# EasyEDA Pro project WEN-FDC2214电容检测.epro

# Board PCB39
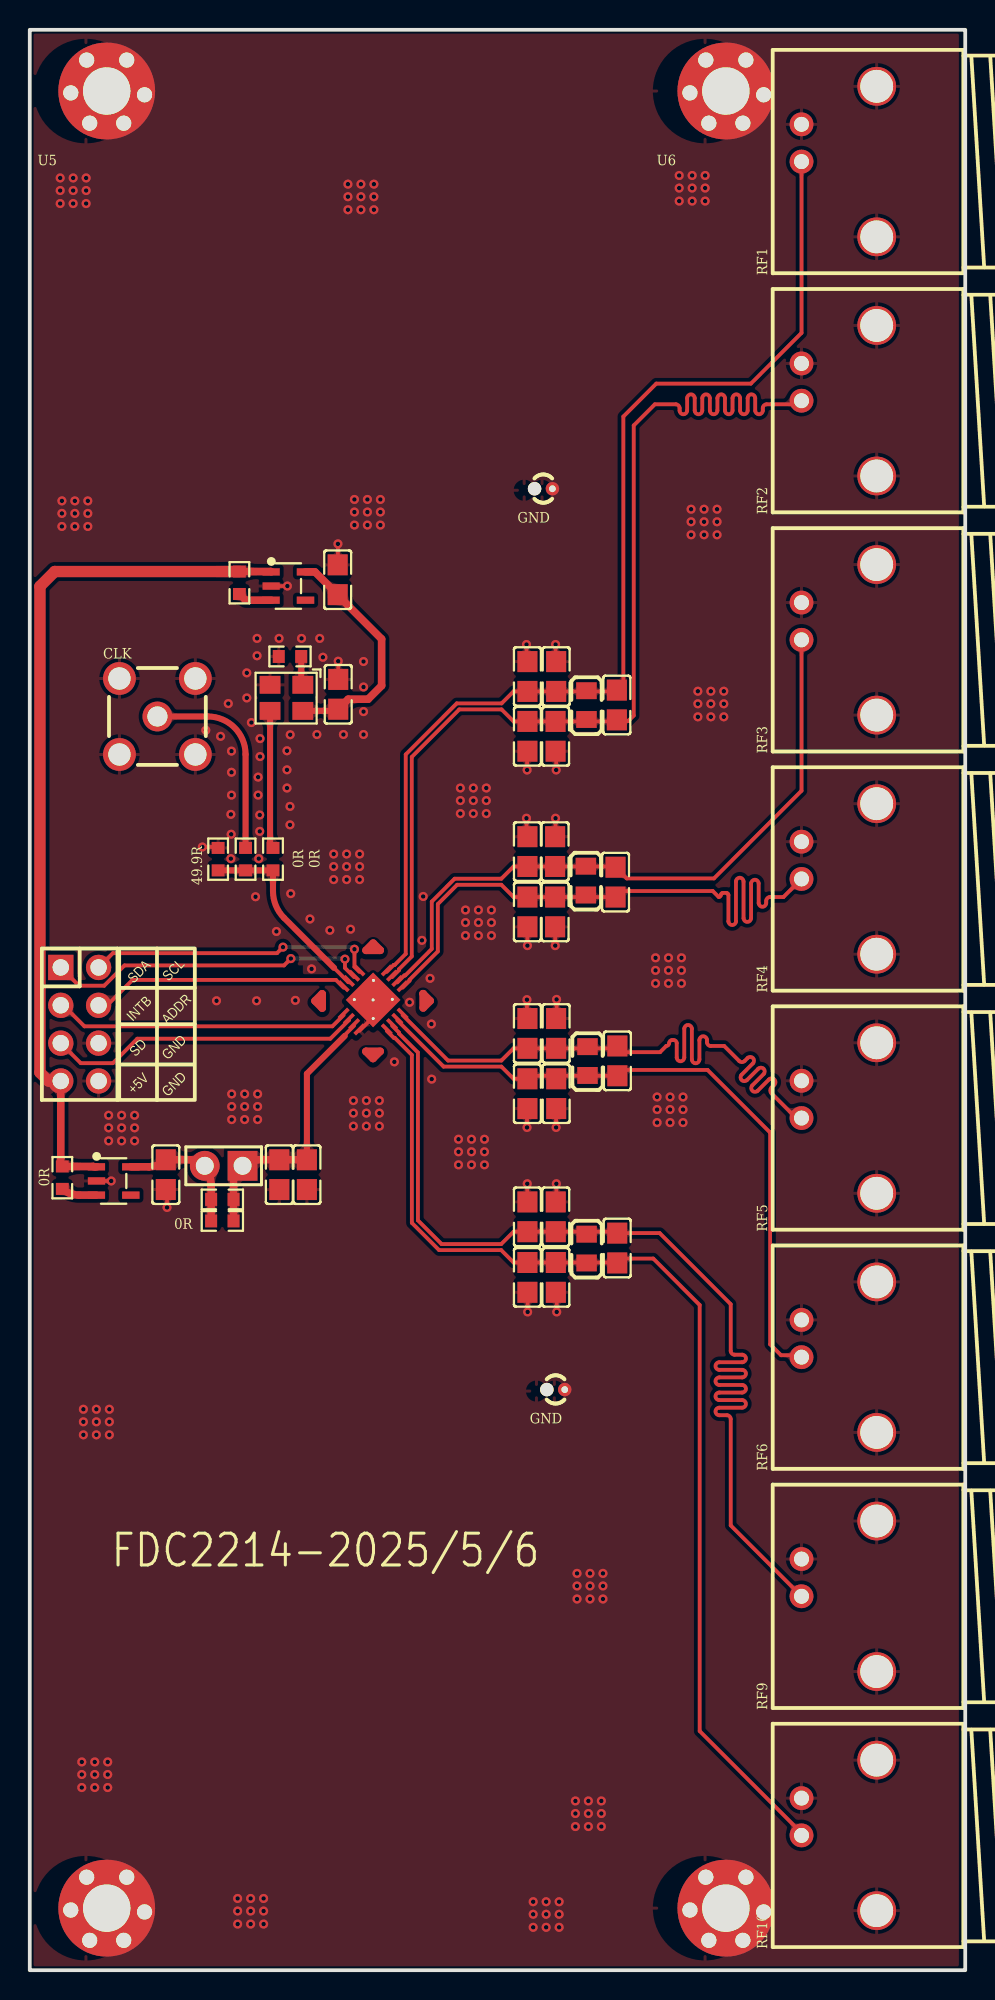
[diagram p0: board, top side]
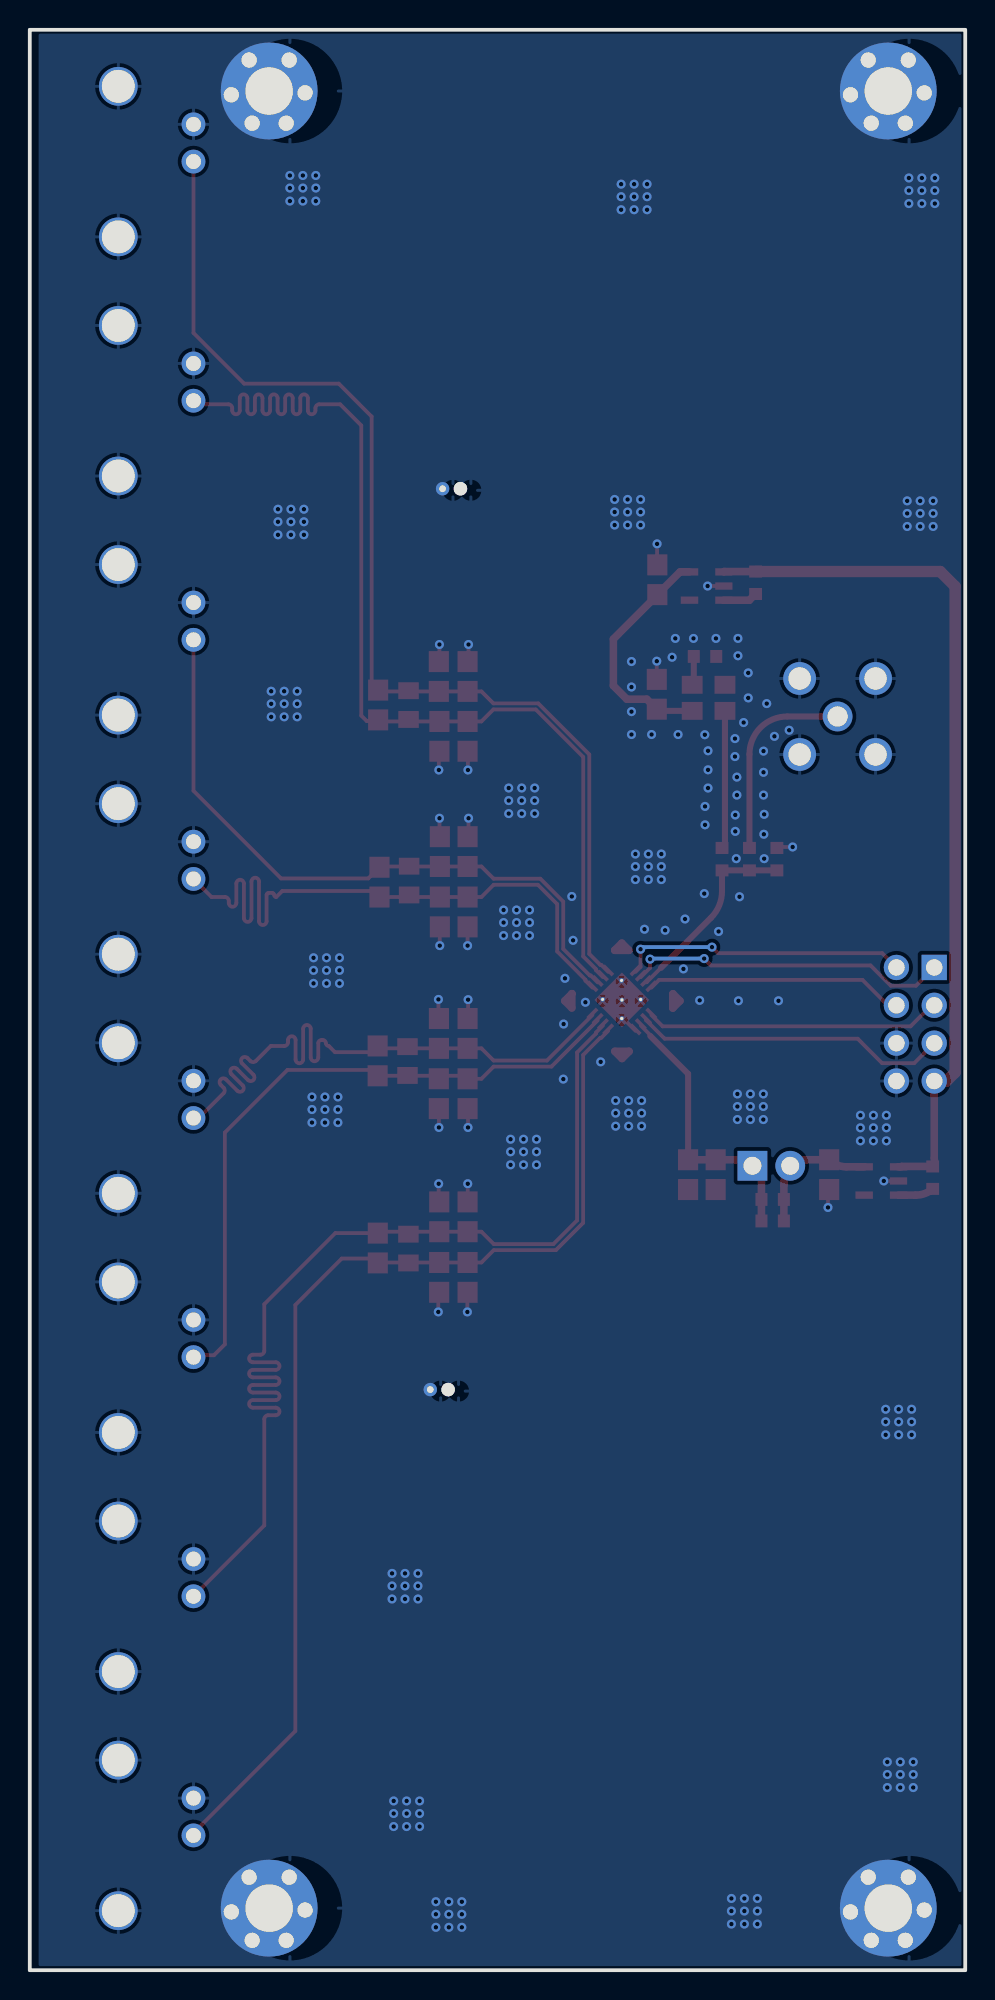
[diagram p1: board, bottom side, seen from below]

Outline 62.83 x 130.2 mm; copper layers: Top Layer, Bottom Layer. Coordinates in mm from the lower left corner of the outline.
Outline path: rectangle 0,130.2 62.83,0
Stack: Top Layer 0.035mm / Dielectric1 1.51mm FR4 er 4.5 / Bottom Layer 0.035mm

## Design rules (mm)
net $1N3217: DP1
net $1N2785: DP1
net $1N3521: DP2
net $1N3494: DP2
net $1N3836: DP4
net $1N3809: DP4
net $1N4151: DP3
net $1N4269: DP3
template: JLCPCB Capability(Two Layers Board)
spacing copperThickness1oz (default): track to track 0.102, other pairs 0.152 to 0.3
spacing copperThickness2oz: track to track 0.203, other pairs 0.152 to 0.3
track width copperThickness1oz (default): min 0.127, default 0.254, max 2.54
track width copperThickness2oz: min 0.203, default 0.254, max 2.54
differential pair differentialPair (default): width min 0.127, default 0.254, max 2.54; gap min 0.152, default 0.152
via viaSize (default): diameter min 0.5, default 0.61, max 10; hole min 0.3, default 0.305, max 6.3

## Placement (name value [footprint] x y rotation side)
0R  -  [R0603]  14.49 74.55 270 top
0R1  0R  [R0603]  17.48 88.15 180 top
0R2  0R  [R0603]  14.08 93.1 90 top
0R#2  -  [R0603]  16.34 74.55 270 top
0R#3  -  [R0603]  2.19 53.18 90 top
0R#4  -  [R0603]  12.93 51.72 0 top
4.7uF  4.7uF  [C0805]  9.14 53.38 90 top
4.7uF1  4.7uF  [C0805]  20.68 93.3 270 top
33pF  -  [C0805]  39.43 84.9 90 top
33pF#2  -  [C0805]  39.34 73.01 90 top
33pF#3  -  [C0805]  39.47 61.02 90 top
33pF#4  -  [C0805]  39.46 48.46 90 top
49.9R  49.9R  [R0603]  12.65 74.55 270 top
100nF  -  [C0805]  16.76 53.38 90 top
100nF2  10nF  [C0805]  20.72 85.61 270 top
100nF#2  -  [C0805]  18.61 53.38 90 top
100nF#3  -  [C0805]  33.42 86.81 270 top
100nF#4  -  [C0805]  33.42 82.79 270 top
100nF#5  -  [C0805]  35.35 86.81 270 top
100nF#6  -  [C0805]  35.32 82.79 270 top
100nF#7  -  [C0805]  35.28 75.06 270 top
100nF#8  -  [C0805]  35.28 71.01 270 top
100nF#9  -  [C0805]  33.42 75.06 270 top
100nF#10  -  [C0805]  33.42 71.01 270 top
100nF#11  -  [C0805]  33.42 62.86 270 top
100nF#12  -  [C0805]  35.36 58.82 270 top
100nF#13  -  [C0805]  35.35 62.86 270 top
100nF#14  -  [C0805]  33.42 58.81 270 top
100nF#15  -  [C0805]  35.33 50.55 270 top
100nF#16  -  [C0805]  35.33 46.49 270 top
100nF#17  -  [C0805]  33.42 50.55 270 top
100nF#18  -  [C0805]  33.42 46.49 270 top
CLK  BWSMA-KE-Z001  [SMA-TH_BWSMA-KE-Z001]  8.57 84.13 0 top
GND  -  [测试环]  33.8 99.36 0 top
GND#2  -  [测试环]  34.63 38.91 0 top
H1  PZ254V-12-8P  [HDR-TH_8P-P2.54-V-M-R2-C4-S2.54]  3.35 63.48 270 top
J1  PZ254V-11-02P  [HDR-TH_2P-P2.54-V-M]  13.02 53.98 180 top
L1  18uH  [L0805]  37.39 84.89 90 top
L2  18uH  [L0805]  37.35 73.11 90 top
L3  18uH  [L0805]  37.46 61 90 top
L5  18uH  [L0805]  37.4 48.42 90 top
OSC1  40MHz  [OSC-SMD_4P-L3.2-W2.5-BL]  17.24 85.38 180 top
R2  0R  [R0603]  12.93 50.28 0 top
RF1  KH-BNC50-3511  [ANT-TH_KH-BNC50-3511]  54.36 121.36 90 top
RF2  KH-BNC50-3511  [ANT-TH_KH-BNC50-3511]  54.36 105.31 90 top
RF3  KH-BNC50-3511  [ANT-TH_KH-BNC50-3511]  54.36 89.27 90 top
RF4  KH-BNC50-3511  [ANT-TH_KH-BNC50-3511]  54.36 73.22 90 top
RF5  KH-BNC50-3511  [ANT-TH_KH-BNC50-3511]  54.36 57.18 90 top
RF6  KH-BNC50-3511  [ANT-TH_KH-BNC50-3511]  54.36 41.13 90 top
RF9  KH-BNC50-3511  [ANT-TH_KH-BNC50-3511]  54.36 25.09 90 top
RF10  KH-BNC50-3511  [ANT-TH_KH-BNC50-3511]  54.36 9.05 90 top
U1  FDC2212  [WQFN RGH-16]  23.06 65.01 315 top
U2  SPX3819M5-L-3-3/TR  [SOT-23-5_L3.0-W1.7-P0.95-LS2.8-BL]  5.63 52.96 270 top
U3  -  [My_M3螺丝孔]  3.77 4.16 0 top
U4  -  [My_M3螺丝孔]  45.35 4.16 0 top
U5  -  [My_M3螺丝孔]  3.77 126.1 0 top
U6  -  [My_M3螺丝孔]  45.35 126.1 0 top
U7  SPX3819M5-L-3-3/TR  [SOT-23-5_L3.0-W1.7-P0.95-LS2.8-BL]  17.37 92.88 270 top

## Footprints (pads in the part's own frame, mm; a bottom-side part is the same pattern mirrored in y, then rotated)
ANT-TH_KH-BNC50-3511
  round 1.6 hole 1: 1(0,2.525) 2(2.5,2.525)
  round 2.601 hole 2.2: 3(5.05,-2.525) 4(-5.05,-2.525)
C0805
  rect 1.41x1.35 smd: 1(-1,0) 2(1,0)
HDR-TH_2P-P2.54-V-M
  rect 2x2 hole 1.2: 1(-1.27,0)
  round 2 hole 1.2: 2(1.27,0)
HDR-TH_8P-P2.54-V-M-R2-C4-S2.54
  rect 1.7x1.7 hole 1.1: 1(-3.81,-1.27)
  round 1.7 hole 1.1: 2(-3.81,1.27) 3(-1.27,-1.27) 4(-1.27,1.27) 5(1.27,-1.27) 6(1.27,1.27) 7(3.81,-1.27) 8(3.81,1.27)
L0805
  rect 1.133x1.377 smd: 1(-0.966,0) 2(0.966,0)
My_M3螺丝孔
  round 1.016 hole 1.021x1.016: 1(-1.016,-0.127) 1(0.051,2.078) 1(0.254,-2.159) 1(2.54,-2.159) 1(2.743,2.078) 1(3.937,-0.254)
  round 6.5 hole 3.18x3.175: 1(1.397,0)
OSC-SMD_4P-L3.2-W2.5-BL
  rect 1.4x1.2 smd: 1(-1.1,-0.875) 2(1.1,-0.875) 3(1.1,0.875) 4(-1.1,0.875)
R0603
  rect 0.806x0.864 smd: 1(-0.753,0) 2(0.753,0)
SMA-TH_BWSMA-KE-Z001
  round 2.2 hole 1.5: 1(-2.55,-2.55) 2(-2.55,2.55) 3(2.55,2.55) 4(2.55,-2.55)
  round 2 hole 1.35: 5(0,0)
SOT-23-5_L3.0-W1.7-P0.95-LS2.8-BL
  rect 0.49x1.157 smd: 1(-0.95,-1.153) 2(0,-1.153) 3(0.95,-1.153)
  rect 0.49x1.175 smd: 4(0.95,1.153) 5(-0.95,1.153)
WQFN RGH-16
  rect 0.9x0.25 smd: 1(-2.118,0.819) 2(-2.118,0.319) 3(-2.118,-0.181) 4(-2.118,-0.681) 9(1.982,-0.681) 10(1.982,-0.181) 11(1.982,0.319) 12(1.982,0.819)
  rect 0.25x0.9 smd: 5(-0.818,-1.982) 6(-0.318,-1.982) 7(0.182,-1.982) 8(0.682,-1.982) 13(0.682,2.119) 14(0.182,2.119) 15(-0.318,2.119) 16(-0.818,2.119)
  round 0.3 hole 0.2: 17(-0.977,1.008) 17(-0.977,-0.806) 17(-0.068,0.069) 17(0.821,1.008) 17(0.821,-0.807)
  rect 2.6x2.6 smd: 17(-0.068,0.069)
测试环
  round 0.9 hole 0.914x0.45: 1(0.103,0.051)
  round 0.9 hole 0.45: 1(1.304,0.051)

## Nets
3V3: 0R#4.1 4.7uF.2 J1.2 R2.1 U2.5
+5V: 0R2.2 0R#3.2 H1.7 U2.1 U7.1
D3V3: 4.7uF1.2 100nF2.2 OSC1.4 U7.5
GND: 0R1.2 4.7uF.1 4.7uF1.1 49.9R.1 100nF.1 100nF2.1 100nF#2.1 100nF#3.1 100nF#4.2 100nF#5.1 100nF#6.2 100nF#7.1 100nF#8.2 100nF#9.1 100nF#10.2 100nF#11.1 100nF#12.2 100nF#13.1 100nF#14.2 100nF#15.1 100nF#16.2 100nF#17.1 100nF#18.2 CLK.1 CLK.2 CLK.3 CLK.4 GND.1 GND#2.1 H1.6 H1.8 OSC1.2 RF1.2 RF1.3 RF1.4 RF2.2 RF2.3 RF2.4 RF3.2 RF3.3 RF3.4 RF4.2 RF4.3 RF4.4 RF5.2 RF5.3 RF5.4 RF6.2 RF6.3 RF6.4 RF9.2 RF9.3 RF9.4 RF10.2 RF10.3 RF10.4 U1.8 U1.17 U2.2 U3.1 U4.1 U5.1 U6.1 U7.2
VDD: 0R#4.2 100nF.2 100nF#2.2 J1.1 R2.2 U1.7
ADDR: H1.4 U1.4
INTB: H1.3 U1.5
SCL: H1.2 U1.1
SD: H1.5 U1.6
SDA: H1.1 U1.2
$1N1626: 0R.1 CLK.5
$1N1630: 0R.2 0R#2.2 49.9R.2 U1.3
$1N1964: 0R1.1 OSC1.1
$1N2113: 0R#2.1 OSC1.3
$1N2627: 0R#3.1 U2.3
$1N2785: 33pF.1 100nF#4.1 100nF#6.1 L1.1 RF2.1 U1.15
$1N3217: 33pF.2 100nF#3.2 100nF#5.2 L1.2 RF1.1 U1.16
$1N3494: 33pF#2.1 100nF#8.1 100nF#10.1 L2.1 RF4.1 U1.13
$1N3521: 33pF#2.2 100nF#7.2 100nF#9.2 L2.2 RF3.1 U1.14
$1N3809: 33pF#3.1 100nF#12.1 100nF#14.1 L3.1 RF6.1 U1.11
$1N3836: 33pF#3.2 100nF#11.2 100nF#13.2 L3.2 RF5.1 U1.12
$1N4151: 33pF#4.2 100nF#15.2 100nF#17.2 L5.2 RF9.1 U1.10
$1N4269: 33pF#4.1 100nF#16.1 100nF#18.1 L5.1 RF10.1 U1.9
$1N6832: 0R2.1 U7.3

Pads without a net: U2 4; U7 4

## Via types
v1: diameter 0.61, hole 0.305, Top Layer to Bottom Layer, 278 vias

## Routing (per net, layer and track width the routed paths; a pad name or vN(x,y) marks a point on that pad's centre or on a via; arc(x,y) is an arc through that point)
3V3: length 9.2
  Top Layer w0.508: U2.5 7.99,53.91 arc(8.61,54.03) 4.7uF.2 10.77,54.38 arc(11.2,54.32) 11.58,54.12 ; R2.1 0R#4.1 12.18,52.67 arc(12.02,53.46) 11.58,54.12 ; 11.58,54.12 arc(11.67,54.05) J1.2
+5V: length 58.3
  Top Layer w0.508: 0R2.2 16.19,93.85 U7.1 ; H1.7 2.08,54.49 arc(2.08,54.2) 0R#3.2 4.26,53.93 arc(4.37,53.89) U2.1
  Top Layer w0.762: H1.7 1.25,59.67 0.68,60.24 0.68,92.85 1.68,93.85 0R2.2
D3V3: length 16.1
  Top Layer w0.406: 100nF2.2 20.6,84.5 OSC1.4
  Top Layer w0.508: 100nF2.2 21.39,85.29 22.73,85.29 23.63,86.19 23.63,89.32 20.68,92.27 4.7uF1.2 19.15,93.83 U7.5
GND: length 29.9
  Top Layer w0.254: 22.14,63.03 23.06,63.95 23.06,65.01 ; 33.36,87.75 33.36,89.03 ; 33.41,51.57 33.41,52.84 ; 33.4,57.83 v1(33.4,56.55) ; 35.35,57.76 35.35,56.48 ; 35.39,45.38 35.39,44.1 ; v1(11.59,75.37) 12.59,75.37 arc(12.63,75.35) 49.9R.1 ; 33.4,81.81 v1(33.4,80.53) ; 35.37,51.49 v1(35.37,52.77) ; 35.29,70.03 v1(35.29,68.75) ; v1(20.7,95.71) 20.7,94.32 4.7uF1.1 ; 35.38,63.86 v1(35.38,65.14) ; 33.39,63.84 v1(33.39,65.12) ; U7.2 v1(17.3,92.88) ; 35.31,87.68 v1(35.31,88.96) ; 33.44,45.45 v1(33.44,44.17) ; 33.36,76.09 33.36,77.37 ; 100nF2.1 v1(20.72,87.84) ; 35.36,81.74 35.36,80.46 ; 35.31,76.02 v1(35.31,77.3) ; U2.2 v1(5.47,52.96) ; 100nF#10.2 33.42,68.73 ; v1(9.22,51.18) 9.22,52.19 arc(9.2,52.29) 4.7uF.1
  vias: v1(2.04,120.26) v1(2.04,119.42) v1(2.04,118.54) v1(2.16,98.59) v1(2.16,97.75) v1(2.16,96.88) v1(2.91,120.26) v1(2.91,119.42) v1(2.91,118.54) v1(3.03,98.59) v1(3.03,97.75) v1(3.03,96.88) v1(3.49,13.97) v1(3.49,13.13) v1(3.49,12.26) v1(3.6,37.64) v1(3.6,36.8) v1(3.6,35.92) v1(3.79,120.26) v1(3.79,119.42) v1(3.79,118.54) v1(3.9,98.59) v1(3.9,97.75) v1(3.9,96.88) v1(4.36,13.97) v1(4.36,13.13) v1(4.36,12.26) v1(4.47,37.64) v1(4.47,36.8) v1(4.47,35.92) v1(5.23,13.97) v1(5.23,13.13) v1(5.23,12.26) v1(5.3,57.37) v1(5.3,56.52) v1(5.3,55.65) v1(5.34,37.64) v1(5.34,36.8) v1(5.34,35.92) v1(6.17,57.37) v1(6.17,56.52) v1(6.17,55.65) v1(7.04,57.37) v1(7.04,56.52) v1(7.04,55.65) v1(11.83,83.2) v1(12.54,65.05) v1(12.82,82.79) v1(13.33,84.99) v1(13.55,81.8) v1(13.55,80.38) v1(13.55,78.85) v1(13.51,77.56) v1(13.53,76.22) v1(13.51,74.59) v1(13.56,58.8) v1(13.56,57.95) v1(13.56,57.08) v1(13.96,4.81) v1(13.96,3.97) v1(13.96,3.1) v1(14.43,58.8) v1(14.43,57.95) v1(14.43,57.08) v1(14.58,87.05) v1(14.58,85.37) v1(14.88,83.72) v1(14.83,4.81) v1(14.83,3.97) v1(14.83,3.1) v1(15.16,72.03) v1(15.26,89.36) v1(15.26,88.2) v1(15.23,65.05) v1(15.34,80.06) v1(15.34,78.85) v1(15.38,74.59) v1(15.3,58.8) v1(15.3,57.95) v1(15.3,57.08) v1(15.47,82.64) v1(15.47,81.44) v1(15.44,77.52) v1(15.44,76.42) v1(15.7,4.81) v1(15.7,3.97) v1(15.7,3.1) v1(16.57,69.7) v1(16.74,89.36) v1(17.28,81.82) v1(17.28,80.55) v1(17.28,79.33) v1(17.49,82.9) v1(17.48,78.09) v1(17.48,76.85) v1(17.53,72.24) v1(17.84,65.08) v1(18.25,89.36) v1(18.82,70.54) v1(18.93,67.19) v1(19.29,82.92) v1(19.47,89.36) v1(19.69,88.1) v1(20.16,69.78) v1(20.41,74.9) v1(20.41,74.05) v1(20.41,73.18) v1(21.07,82.92) v1(21.28,74.9) v1(21.28,74.05) v1(21.28,73.18) v1(21.37,119.85) v1(21.37,119) v1(21.37,118.13) v1(21.54,69.85) v1(21.74,58.35) v1(21.74,57.51) v1(21.74,56.63) v1(21.81,98.69) v1(21.81,97.85) v1(21.81,96.97) v1(22.15,74.9) v1(22.15,74.05) v1(22.15,73.18) v1(22.24,119.85) v1(22.24,119) v1(22.24,118.13) v1(22.42,87.81) v1(22.42,86.1) v1(22.42,84.45) v1(22.42,82.92) v1(22.68,98.69) v1(22.68,97.85) v1(22.68,96.97) v1(22.61,58.35) v1(22.61,57.51) v1(22.61,56.63) v1(23.11,119.85) v1(23.11,119) v1(23.11,118.13) v1(23.48,58.35) v1(23.48,57.51) v1(23.48,56.63) v1(23.55,98.69) v1(23.55,97.85) v1(23.55,96.97) v1(24.49,60.95) v1(25.51,64.95) v1(26.34,69.1) v1(26.42,72.05) v1(26.88,66.55) v1(26.97,63.49) v1(26.99,59.79) v1(28.8,55.76) v1(28.8,54.92) v1(28.8,54.04) v1(28.92,79.33) v1(28.92,78.48) v1(28.92,77.61) v1(29.26,71.14) v1(29.26,70.3) v1(29.26,69.42) v1(29.67,55.76) v1(29.67,54.92) v1(29.67,54.04) v1(29.79,79.33) v1(29.79,78.48) v1(29.79,77.61) v1(30.14,71.14) v1(30.14,70.3) v1(30.14,69.42) v1(30.54,55.76) v1(30.54,54.92) v1(30.54,54.04) v1(30.66,79.33) v1(30.66,78.48) v1(30.66,77.61) v1(31.01,71.14) v1(31.01,70.3) v1(31.01,69.42) v1(33.36,88.96) v1(33.36,77.3) v1(33.42,68.75) v1(33.41,52.77) v1(33.81,4.59) v1(33.81,3.75) v1(33.81,2.88) v1(34.68,4.59) v1(34.68,3.75) v1(34.68,2.88) v1(35.36,80.53) v1(35.35,56.55) v1(35.39,44.17) v1(35.55,4.59) v1(35.55,3.75) v1(35.55,2.88) v1(36.65,11.36) v1(36.65,10.51) v1(36.65,9.64) v1(36.76,26.63) v1(36.76,25.78) v1(36.76,24.91) v1(37.52,11.36) v1(37.52,10.51) v1(37.52,9.64) v1(37.63,26.63) v1(37.63,25.78) v1(37.63,24.91) v1(38.39,11.36) v1(38.39,10.51) v1(38.39,9.64) v1(38.5,26.63) v1(38.5,25.78) v1(38.5,24.91) v1(42.03,67.93) v1(42.03,67.09) v1(42.03,66.22) v1(42.13,58.59) v1(42.13,57.75) v1(42.13,56.88) v1(42.9,67.93) v1(42.9,67.09) v1(42.9,66.22) v1(43,58.59) v1(43,57.75) v1(43,56.88) v1(43.62,120.43) v1(43.62,119.58) v1(43.62,118.71) v1(43.77,67.93) v1(43.77,67.09) v1(43.77,66.22) v1(43.88,58.59) v1(43.88,57.75) v1(43.88,56.88) v1(44.49,120.43) v1(44.49,119.58) v1(44.49,118.71) v1(44.42,98.03) v1(44.42,97.19) v1(44.42,96.32) v1(44.87,85.82) v1(44.87,84.98) v1(44.87,84.1) v1(45.29,98.03) v1(45.29,97.19) v1(45.29,96.32) v1(45.36,120.43) v1(45.36,119.58) v1(45.36,118.71) v1(45.74,85.82) v1(45.74,84.98) v1(45.74,84.1) v1(46.16,98.03) v1(46.16,97.19) v1(46.16,96.32) v1(46.61,85.82) v1(46.61,84.98) v1(46.61,84.1)
VDD: length 18.7
  Top Layer w0.254: 21.79,63.38 21.14,62.74 21.19,62.69
  Top Layer w0.406: 21.15,62.69 18.61,60.15 100nF#2.2
  Top Layer w0.508: R2.2 0R#4.2 13.69,53.37 J1.1 arc(14.74,54.28) 15.27,54.38 100nF.2 100nF#2.2
ADDR: length 17.4
  Top Layer w0.254: H1.4 5.2,64.75 6.9,66.45 20.56,66.45 21.08,65.93
INTB: length 19.9
  Top Layer w0.254: H1.3 2.26,64.75 3.67,63.33 20.32,63.33 21.08,64.09
SCL: length 19.5
  Top Layer w0.254: v1(17.01,68.65) 16.6,68.24 5.58,68.24 H1.2 ; v1(21.81,68.51) 21.81,67.32 22.14,66.99
  Bottom Layer w0.254: v1(17.01,68.65) 21.67,68.65 v1(21.81,68.51)
SD: length 21.1
  Top Layer w0.254: H1.5 3.42,60.86 5.58,60.86 7.22,62.5 20.19,62.5 21.42,63.74 21.43,63.74
SDA: length 21.8
  Top Layer w0.254: H1.1 3.31,66.06 5,66.06 6.36,67.42 17.08,67.42 v1(17.54,67.88) ; v1(21.17,67.84) 21.17,67.25 21.79,66.64
  Bottom Layer w0.254: v1(17.54,67.88) 21.13,67.88 v1(21.17,67.84)
$1N1626: length 13.7
  Top Layer w0.406: CLK.5 11.95,84.13 arc(13.75,83.38) 14.49,81.59 0R.1
$1N1630: length 13.2
  Top Layer w0.254: 20.44,67.26 21.39,66.3 arc(21.41,66.29) 21.43,66.28
  Top Layer w0.406: 49.9R.2 0R.2 0R#2.2 16.34,72.41 arc(16.53,71.44) 17.08,70.61 20.44,67.26
$1N1964: length 1.9
  Top Layer w0.406: OSC1.1 18.23,86.36 0R1.1
$1N2113: length 9
  Top Layer w0.406: 16.14,75.5 OSC1.3
$1N2627: length 2.4
  Top Layer w0.508: U2.3 3.32,52.01 arc(2.72,52.11) 0R#3.1
$1N2785: length 75.6
  Top Layer w0.254: 24.33,66.64 24.8,67.1 24.8,67.17 25.66,68.03 25.66,81.41 28.84,84.6 31.69,84.6 32.49,83.79 100nF#4.1 100nF#6.1 39.33,83.79 33pF.1 39.51,83.82 40.19,83.82 40.56,84.18 40.56,103.65 41.98,105.07 43.39,105.07 arc(43.57,105) 43.64,104.82 43.64,104.66 arc(43.9,104.4) 44.15,104.66 44.15,105.49 arc(44.41,105.74) 44.66,105.49 44.66,104.66 arc(44.91,104.4) 45.17,104.66 45.17,105.49 arc(45.42,105.74) 45.68,105.49 45.68,104.66 arc(45.93,104.4) 46.18,104.66 46.18,105.49 arc(46.44,105.74) 46.69,105.49 46.69,104.66 arc(46.95,104.4) 47.2,104.66 47.2,105.49 arc(47.45,105.74) 47.71,105.49 47.71,104.66 arc(47.96,104.4) 48.22,104.66 48.22,105.49 arc(48.47,105.74) 48.72,105.49 48.72,104.66 arc(48.98,104.4) 49.23,104.66 49.23,104.82 arc(49.31,105) 49.49,105.07 51.59,105.07 RF2.1
$1N3217: length 75.4
  Top Layer w0.254: 23.98,66.99 24.45,67.46 24.51,67.46 25.25,68.19 25.25,81.58 28.68,85 31.69,85 32.49,85.81 100nF#3.2 100nF#5.2 39.34,85.81 33pF.2 39.87,86.33 39.87,104.25 42.08,106.46 48.43,106.46 51.83,109.86 RF1.1
$1N3494: length 45.2
  Top Layer w0.254: 25.04,65.93 25.51,66.4 25.51,66.46 27.41,68.36 27.41,71.54 28.7,72.83 31.67,72.83 32.49,72.01 100nF#10.1 100nF#8.1 39.34,72.01 ; 33pF#2.1 39.75,72.41 45.87,72.41 46.28,72.01 arc(46.37,72.05) 46.42,72.15 arc(46.46,72.25) 46.56,72.29 46.78,72.29 arc(46.88,72.25) 46.92,72.15 46.92,70.39 arc(47.18,70.13) 47.43,70.39 47.43,73.05 arc(47.69,73.31) 47.94,73.05 47.94,70.6 arc(48.19,70.34) 48.45,70.6 48.45,72.92 arc(48.7,73.17) 48.96,72.92 48.96,71.61 arc(49.21,71.36) 49.46,71.61 49.46,71.76 arc(49.54,71.94) 49.72,72.01 50.62,72.01 RF4.1
$1N3521: length 45.1
  Top Layer w0.254: 24.69,66.28 25.15,66.75 25.22,66.75 27,68.53 27,71.71 28.53,73.24 31.67,73.24 32.49,74.06 100nF#9.2 100nF#7.2 39.29,74.06 33pF#2.2 40.09,73.26 45.95,73.26 51.83,79.14 RF3.1
$1N3809: length 45.3
  Top Layer w0.254: 24.69,63.74 27.79,60.63 31.68,60.63 32.49,59.81 100nF#14.1 33.63,60.02 33pF#3.1 39.86,60.41 45.52,60.41 49.73,56.21 49.73,42 50.46,41.26 51.7,41.26 RF6.1
$1N3836: length 45.5
  Top Layer w0.254: RF5.1 51.48,57.18 49.81,58.85 arc(49.73,59.03) 49.81,59.21 50.01,59.41 arc(50.01,59.77) 49.65,59.77 48.89,59.01 arc(48.53,59.01) 48.53,59.37 49.29,60.13 arc(49.29,60.49) 48.93,60.49 48.17,59.73 arc(47.81,59.73) 47.81,60.09 48.57,60.85 arc(48.57,61.21) 48.21,61.21 48.01,61.01 arc(47.83,60.93) 47.65,61.01 46.64,62.02 45.74,62.02 arc(45.56,62.09) 45.48,62.27 45.48,62.41 arc(45.23,62.67) 44.98,62.41 44.98,61.11 arc(44.72,60.86) 44.47,61.11 44.47,63.17 arc(44.21,63.43) 43.96,63.17 43.96,61.24 arc(43.71,60.99) 43.45,61.24 43.45,62.21 arc(43.39,62.35) 43.25,62.41 43.14,62.41 arc(43,62.35) 42.94,62.21 arc(42.89,62.07) 42.75,62.02 42.33,61.6 39.88,61.6 33pF#3.2 39.31,61.86 100nF#13.2 100nF#11.2 32.49,61.86 31.68,61.04 28.09,61.04 25.04,64.09
$1N4151: length 73.8
  Top Layer w0.254: 24.33,63.38 24.8,62.92 24.8,62.85 26.07,61.58 26.07,50.32 27.66,48.72 31.66,48.72 32.49,49.55 100nF#17.2 100nF#15.2 39.36,49.55 33pF#4.2 42.31,49.46 47.08,44.69 47.08,41.56 arc(47.15,41.38) 47.33,41.3 47.85,41.3 arc(48.1,41.05) 47.85,40.79 46.31,40.79 arc(46.06,40.54) 46.31,40.29 47.85,40.29 arc(48.1,40.03) 47.85,39.78 46.31,39.78 arc(46.06,39.52) 46.31,39.27 47.85,39.27 arc(48.1,39.02) 47.85,38.76 46.31,38.76 arc(46.06,38.51) 46.31,38.25 47.85,38.25 arc(48.1,38) 47.85,37.75 46.31,37.75 arc(46.06,37.49) 46.31,37.24 46.82,37.24 arc(47,37.16) 47.08,36.98 47.08,29.85 RF9.1
$1N4269: length 73.9
  Top Layer w0.254: 33pF#4.1 39.46,47.49 ; 39.46,47.49 100nF#16.1 100nF#18.1 32.49,47.49 31.66,48.32 27.49,48.32 25.66,50.15 25.66,61.41 24.51,62.56 24.45,62.56 23.98,63.03 ; 39.46,47.49 39.46,47.56 39.65,47.75 41.88,47.75 44.99,44.63 44.99,16.05 51.83,9.21 RF10.1
$1N6832: length 2.3
  Top Layer w0.508: U7.3 14.5,91.93 0R2.1

## Copper pours and planes (outline as drawn; the poured copper is in the pictures)
GND on Top Layer: 0.01,130.22 62.4,130.22 62.4,-0.05 0.01,-0.05
GND on Bottom Layer: -0.16,130.54 62.23,130.54 62.23,0.27 -0.16,0.27

Small or netless copper shapes (teardrops, artwork), in the pictures only: 168 on Top Layer, 4 on Bottom Layer

## Text on the board
Top Silkscreen Layer: FDC2214-2025/5/6 | INTB | SDA | +5V | SD | ADDR | GND | SCL
